# EasyEDA Pro project ProPrj_OHPP-001A-boltON.epro

# Schematic BoltON

## Sheets
1 BoltON: Board Name: Board1; Create Date: 2025-05-22; Page Name: BoltON; Project Name: OHPP-001A-boltON (radio board connector); Schematic Name: BoltON; Update Date: 2025-06-24; Company: Silicon Labs; Page Size: A3; Version: OHPP-001A
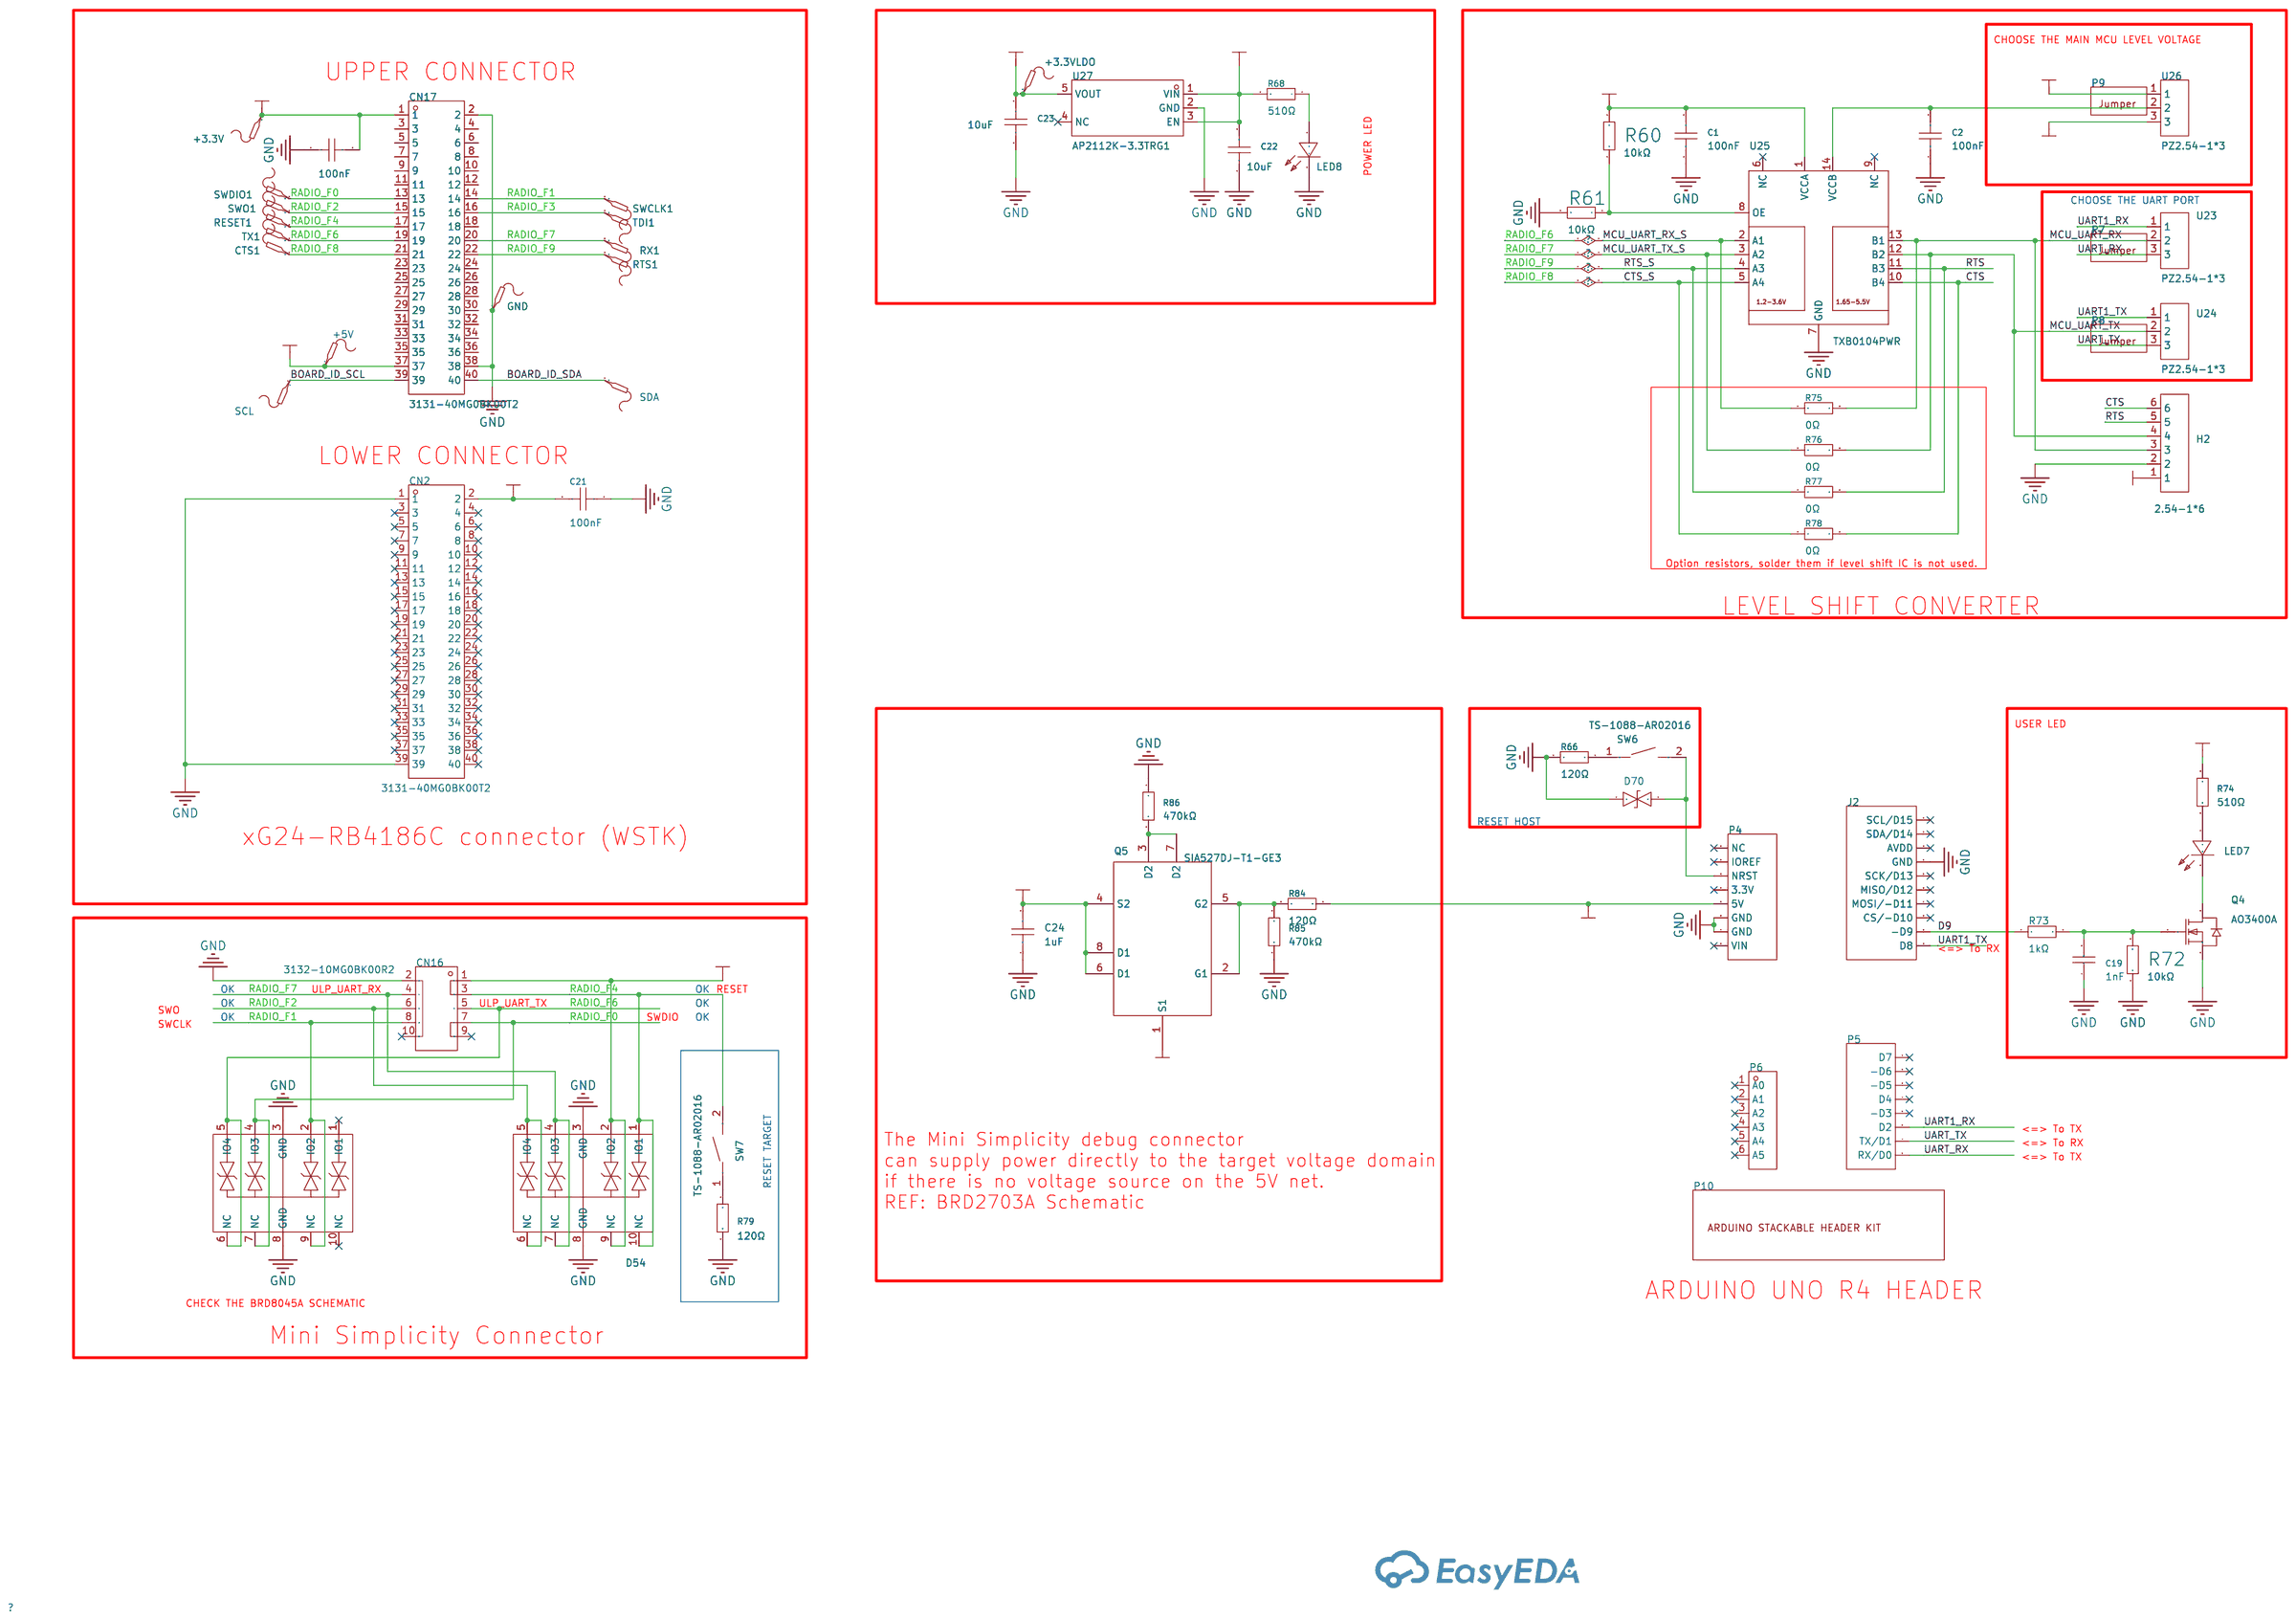
[diagram p0: BoltON]
2 Block Diagram: Page Name: Block Diagram; Project Name: boltON (radio board connector); Update Date: 2025-05-26
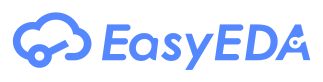
[diagram p1: Block Diagram]

## Parts
+3.3V  -  [Test-Point-0.5mm]  (no BOM)
+3.3VLDO  -  [Test-Point-0.5mm]  (no BOM)
+5V  -  [Test-Point-0.5mm]  (no BOM)
C1  100nF  [C0603]
C2  100nF  [C0603]
C19  1nF  [C0603]
C20  100nF  [C0603]
C21  100nF  [C0603]
C22  10uF  [C0603]
C23  10uF  [C0603]
C24  1uF  [C0603]
CN2  3131-40MG0BK00T2  [CONN-SMD_40P-P1.27_WCON_3131-40MG0BK00T2]
CN16  3132-10MG0BK00R2  [IDC-SMD_3132-10MG0BK00R2]
CN17  3131-40MG0BK00T2  [CONN-SMD_40P-P1.27_WCON_3131-40MG0BK00T2]
CTS1  -  [Test-Point-0.5mm]  (no BOM)
D54  TPD4E02B04DQAR  [USON-10_L2.5-W1.0-P0.50-BL]
D69  TPD4E02B04DQAR  [USON-10_L2.5-W1.0-P0.50-BL]
D70  TPD1E0B04DPLR  [TSSLP-2-3_L0.6-W0.3-P0.35-BI]  (no BOM)
GND  -  [Test-Point-0.5mm]  (no BOM)
H2  2.54-1*6  [HDR-TH_6P-P2.54-V-M]
J2  2.54-1*10P母  [HDR-TH_10P-P2.54-V-F]  (no BOM)
LED7  KT-0805G  [LED0805-R-RD]
LED8  NCD0805R1  [LED0805-R-RD]
P4  2.54-1*8P母环保  [HDR-TH_8P-P2.54-V-F-1]  (no BOM)
P5  2.54-1*8P母环保  [HDR-TH_8P-P2.54-V-F-1_1]  (no BOM)
P6  2.54-1*6P母  [HDR-TH_6P-P2.54-V-F]  (no BOM)
P7  -
P8  -
P9  -
P10  -
Q4  AO3400A  [SOT-23-3_L2.9-W1.3-P1.90-LS2.4-BR]
Q5  SIA527DJ-T1-GE3  [POWERPAK-SC-70-6_L2.0-W2.0-P0.65-BL]
R60  10kΩ  [R0603]
R61  10kΩ  [R0603]  (no BOM)
R66  120Ω  [R0603]
R68  510Ω  [R0603]
R72  10kΩ  [R0603]
R73  1kΩ  [R0603]
R74  510Ω  [R0603]
R75  0Ω  [R0402]  (no BOM)
R76  0Ω  [R0402]  (no BOM)
R77  0Ω  [R0402]  (no BOM)
R78  0Ω  [R0402]  (no BOM)
R79  120Ω  [R0603]
R84  120Ω  [R0603]
R85  470kΩ  [R0603]
R86  470kΩ  [R0603]  (no BOM)
RESET1  -  [Test-Point-0.5mm]  (no BOM)
RTS1  -  [Test-Point-0.5mm]  (no BOM)
RX1  -  [Test-Point-0.5mm]  (no BOM)
SCL  -  [Test-Point-0.5mm]  (no BOM)
SDA  -  [Test-Point-0.5mm]  (no BOM)
SW6  TS-1088-AR02016  [SW-SMD_L3.9-W3.0-P4.45]
SW7  TS-1088-AR02016  [SW-SMD_L3.9-W3.0-P4.45]
SWCLK1  -  [Test-Point-0.5mm]  (no BOM)
SWDIO1  -  [Test-Point-0.5mm]  (no BOM)
SWO1  -  [Test-Point-0.5mm]  (no BOM)
TDI1  -  [Test-Point-0.5mm]  (no BOM)
TX1  -  [Test-Point-0.5mm]  (no BOM)
U23  PZ2.54-1*3  [HDR-TH_3P-P2.54-V-M]
U24  PZ2.54-1*3  [HDR-TH_3P-P2.54-V-M]
U25  TXB0104PWR  [TSSOP-14_L5.0-W4.4-P0.65-LS6.4-BL]
U26  PZ2.54-1*3  [HDR-TH_3P-P2.54-V-M]
U27  AP2112K-3.3TRG1  [SOT-25-5_L2.9-W1.6-P0.95-LS2.8-BL]

## Library data of the parts
+3.3V +3.3VLDO +5V CTS1 GND RESET1 RTS1 RX1 SCL SDA SWCLK1 SWDIO1 SWO1 TDI1 TX1 = Test-Point: Test Point 测试点
C1 C2 C20 C21 = CC0603KRX7R9BB104: Capacitance: Tolerance:±10% Tolerance:±10% Voltage Rated: Temperature Coefficient:; LCSC Part Name: 100nF ±10% 50V; Supplier Part: C14663; Manufacturer: YAGEO(国巨); Supplier Footprint: 0603; JLCPCB Part Class: Basic Part; Datasheet: https://atta.szlcsc.com/upload/public/pdf/source/20180910/C282072_33301C7F631E79921B82A8DAC6BCC5B3.pdf; Supplier: LCSC; Tolerance: ±10%
C19 = CL10B102KB8NNNC: Capacitance: Tolerance:±10% Tolerance:±10% Voltage Rated: Temperature Coefficient:; LCSC Part Name: 1nF ±10% 50V; Supplier Part: C1588; Manufacturer: SAMSUNG(三星); Supplier Footprint: 0603; JLCPCB Part Class: Basic Part; Datasheet: https://atta.szlcsc.com/upload/public/pdf/source/20160218/1457707763339.pdf; Supplier: LCSC; Tolerance: ±10%
C22 C23 = CL10A106MA8NRNC: Capacitance: Tolerance:±20% Tolerance:±20% Voltage Rated: Temperature Coefficient:; LCSC Part Name: 10uF ±20% 25V; Supplier Part: C96446; Manufacturer: SAMSUNG(三星); Supplier Footprint: 0603; JLCPCB Part Class: Basic Part; Datasheet: https://atta.szlcsc.com/upload/public/pdf/source/20160218/1457707763339.pdf; Supplier: LCSC; Tolerance: ±20%
C24 = CL10A105KB8NNNC: Capacitance: Tolerance:±10% Tolerance:±10% Voltage Rated: Temperature Coefficient:; LCSC Part Name: 1uF ±10% 50V; Supplier Part: C15849; Manufacturer: SAMSUNG(三星); Supplier Footprint: 0603; JLCPCB Part Class: Basic Part; Datasheet: https://atta.szlcsc.com/upload/public/pdf/source/20160218/1457707763339.pdf; Supplier: LCSC; Tolerance: ±10%
CN2 = 3131-40MG0BK00T2: Connector Type:Simple cow constellation Pitch:1.27mm Number of Positions or Pins:2x20P Current Rating:1A Voltage Rating (Max):- Holder Type:Standing paste Row Spacing:1.27mm Number of Rows:2 Number of PINs Per Row:20 Operating Temperature:-40℃~+105℃ Opera; LCSC Part Name: 1.27mm 2x20P 排数:2 每排P数:20; Supplier Part: C976753; Manufacturer: Wcon(维峰电子); Supplier Footprint: SMD,P=1.27mm; JLCPCB Part Class: Extended Part; Datasheet: https://atta.szlcsc.com/upload/public/pdf/source/20211202/B702BBAB0AED51B28E1877A6EDDD5ECD.pdf; Supplier: LCSC; Connector Type: Simple cow constellation; Pitch: 1.27mm; Number of Positions or Pins: 2x20P; Current Rating: 1A; Holder Type: Standing paste; Row Spacing: 1.27mm; Number of Rows: 2; Number of PINs Per Row: 20; Operating Temperature: -40℃~+105℃
CN16 = 3132-10MG0BK00R2: Connector Type:简牛座 Pitch:1.27mm Structure:2x5P Holder Type:Brick nogging Row Spacing:1.27mm Number of Rows:2 Pin Number in each Row:5 Contact Material:Brass Contact Plating:Gold; Supplier: LCSC; Supplier Part: C783843; Manufacturer: Wcon(维峰电子); LCSC Part Name: 1.27mm 2x5P 排数:2 每排P数:5; Supplier Footprint: SMD,P=1.27mm; Datasheet: https://atta.szlcsc.com/upload/public/pdf/source/20200914/C783843_74B4F3B0F5055CA38342214C72674E3E.pdf; Connector Type: 简牛座; Pitch: 1.27mm; Structure: 2x5P; Holder Type: Brick nogging; Row Spacing: 1.27mm; Number of Rows: 2; Pin Number in each Row: 5; Contact Material: Brass; Contact Plating: Gold
CN17 = 3131-40MG0BK00T2-UP-CP-V1.0.0: Connector Type:Simple cow constellation Pitch:1.27mm Number of Positions or Pins:2x20P Current Rating:1A Voltage Rating (Max):- Holder Type:Standing paste Row Spacing:1.27mm Number of Rows:2 Number of PINs Per Row:20 Operating Temperature:-40℃~+105℃ Opera; LCSC Part Name: 1.27mm 2x20P 排数:2 每排P数:20; Supplier Part: C976753; Manufacturer: Wcon(维峰电子); Supplier Footprint: SMD,P=1.27mm; Datasheet: https://atta.szlcsc.com/upload/public/pdf/source/20211202/B702BBAB0AED51B28E1877A6EDDD5ECD.pdf; Supplier: LCSC; Connector Type: Simple cow constellation; Pitch: 1.27mm; Number of Positions or Pins: 2x20P; Current Rating: 1A; Holder Type: Standing paste; Row Spacing: 1.27mm; Number of Rows: 2; Number of PINs Per Row: 20; Operating Temperature: -40℃~+105℃
D54 D69 = TPD4E02B04DQAR: polarity:Bi-Directional Reverse Stand-Off Voltage (Vrwm):3.6V Maximum Clamping Voltage:8.8V Peak Pulse Current (Ipp)@10/1000us:5A Peak Pulse Power Dissipation (Ppp)@10/1000us:17W Breakdown Voltage:5.5V Operating Temperature:-40℃~+125℃@(Ta) Operating Tempe; LCSC Part Name: 双向ESD; Supplier Part: C106794; Manufacturer: TI(德州仪器); Supplier Footprint: USON-10(1x2.5); JLCPCB Part Class: Extended Part; Datasheet: https://www.ti.com/cn/lit/gpn/tpd4e02b04; Supplier: LCSC; polarity: Bi-Directional; Reverse Stand-Off Voltage (Vrwm): 3.6V; Maximum Clamping Voltage: 8.8V; Peak Pulse Current (Ipp)@10/1000us: 5A; Peak Pulse Power Dissipation (Ppp)@10/1000us: 17W; Breakdown Voltage: 5.5V; Operating Temperature: -40℃~+125℃@(Ta); Type: ESD
D70 = TPD1E0B04DPLR: polarity:- Reverse Stand-Off Voltage (Vrwm):3.6V Maximum Clamping Voltage:10.1V Peak Pulse Current (Ipp):1.7A@8/20us Peak Pulse Power Dissipation (Ppp):15W Breakdown Voltage:6.7V Reverse Leakage Current (Ir):- Number of Lines:- Operating Temperature:- Ope; Supplier Part: C913830; Manufacturer: TI(德州仪器); Supplier Footprint: X2-SON-2(0.3x0.6); JLCPCB Part Class: Extended Part; Datasheet: https://www.ti.com/cn/lit/gpn/tpd1e0b04; Supplier: LCSC; Reverse Stand-Off Voltage (Vrwm): 3.6V; Maximum Clamping Voltage: 10.1V; Peak Pulse Current (Ipp): 1.7A@8/20us; Peak Pulse Power Dissipation (Ppp): 15W; Breakdown Voltage: 6.7V; Type: TVS
H2 = 2.54-1*6: Pin Structure:1x6P Pitch:2.54mm Number of Rows:Single Row Number of Pins:6P; Supplier Part: C5156615; Manufacturer: ZHOURI(洲日); Supplier Footprint: 插件,P=2.54mm; JLCPCB Part Class: Extended Part; Datasheet: https://atta.szlcsc.com/upload/public/pdf/source/20250227/F941FC765EF241ABFB2D5D72948A31A5.pdf; Supplier: LCSC; Pin Structure: 1x6P; Pitch: 2.54mm; Number of Rows: Single Row; Number of Pins: 6P
J2 = Arduino_2.54-1*10P: Holes Structure:1x10P Pitch:2.54mm Row Spacing:- Mounting Type:Straight Number of Rows:Plugin Number of Holes:10P Insulation Height:- Contact Material:- Contact Plating:-; Supplier: LCSC; Manufacturer: BOOMELE(博穆精密); Supplier Part: C35445; LCSC Part Name: 间距:2.54mm 1x10P 直插; Supplier Footprint: 插件,P=2.54mm; Datasheet: https://atta.szlcsc.com/upload/public/pdf/source/20200813/C35445_A4147CED0A1C9075722E373C7771E928.pdf; Holes Structure: 1x10P; Pitch: 2.54mm; Mounting Type: Straight; Number of Rows: Plugin; Number of Holes: 10P
LED7 = KT-0805G: Lamp Holder Type:- Emitted Color:Emerald Forward Voltage (VF):- Forward Voltage (VF):- Power Dissipation:- Forward Current:- Dominant Wavelength:- Dominant Wavelength:- Peak Wavelength:- Diode Configuration:- Lens Color:- Color Temperature:- Color Tempera; LCSC Part Name: 0805 翠绿 高亮; Supplier Part: C2297; Manufacturer: KENTO; Supplier Footprint: 0805; JLCPCB Part Class: Basic Part; Datasheet: https://atta.szlcsc.com/upload/public/pdf/source/20170209/1486607340485.pdf; Supplier: LCSC; Emitted Color: Emerald
LED8 = NCD0805R1_C84256: Lamp Holder Type:- Emitted Color:Red Forward Voltage (VF):1.6V~2.6V Forward Voltage (VF):1.6V~2.6V Power Dissipation:65mW Forward Current:20mA Dominant Wavelength:615nm~630nm Dominant Wavelength:615nm~630nm Peak Wavelength:- Diode Configuration:独立二极管 Lens; Supplier Part: C84256; Manufacturer: 国星光电; Supplier Footprint: 0805; JLCPCB Part Class: Basic Part; Datasheet: https://atta.szlcsc.com/upload/public/pdf/source/20200820/C84256_F0A75A43B3EAD75808600A0514C76B99.pdf; Supplier: LCSC; Emitted Color: Red; Forward Voltage (VF): 1.6V~2.6V; Power Dissipation: 65mW; Forward Current: 20mA; Dominant Wavelength: 615nm~630nm; Diode Configuration: 独立二极管; Lens Color: 无色透明透镜; Luminous Intensity: 67mcd~195mcd; Viewing Angle: 130°; Operating Temperature: -30℃~+85℃
P4 = Arduino_2.54-1*8P: Holes Structure:1x8P Pitch:2.54mm Row Spacing:- Mounting Type:Straight Number of Rows:Plugin Number of Holes:8P Insulation Height:- Contact Material:- Contact Plating:-; Supplier: LCSC; Manufacturer: BOOMELE(博穆精密); Supplier Part: C27438; LCSC Part Name: 间距:2.54mm 1x8P 直插; Supplier Footprint: 插件,P=2.54mm; Datasheet: https://atta.szlcsc.com/upload/public/pdf/source/20231221/1CA800C6799ED97958773716FAA1BFFE.pdf; Holes Structure: 1x8P; Pitch: 2.54mm; Mounting Type: Straight; Number of Rows: Plugin; Number of Holes: 8P
P5 = Arduino_2.54-1*8P_1: Holes Structure:1x8P Pitch:2.54mm Row Spacing:- Mounting Type:Straight Number of Rows:Plugin Number of Holes:8P Insulation Height:- Contact Material:- Contact Plating:-; Supplier: LCSC; Manufacturer: BOOMELE(博穆精密); Supplier Part: C27438; LCSC Part Name: 间距:2.54mm 1x8P 直插; Supplier Footprint: 插件,P=2.54mm; Datasheet: https://atta.szlcsc.com/upload/public/pdf/source/20231221/1CA800C6799ED97958773716FAA1BFFE.pdf; Holes Structure: 1x8P; Pitch: 2.54mm; Mounting Type: Straight; Number of Rows: Plugin; Number of Holes: 8P
P6 = Arduino_2.54-1*6P: Holes Structure:1x6P Pitch:2.54mm Row Spacing:- Mounting Type:Straight Number of Rows:Plugin Number of Holes:6P Insulation Height:- Contact Material:- Contact Plating:-; Supplier: LCSC; Manufacturer: BOOMELE(博穆精密); Supplier Part: C40877; LCSC Part Name: 间距:2.54mm 1x6P 直插; Supplier Footprint: 插件,P=2.54mm; Datasheet: https://atta.szlcsc.com/upload/public/pdf/source/20210301/C2718488_F4427B881E42CAA8DDB0B1C12B3A522C.pdf; Holes Structure: 1x6P; Pitch: 2.54mm; Mounting Type: Straight; Number of Rows: Plugin; Number of Holes: 6P
P7-P9 = Jumpers: Open top 3A 2.54mm P=2.54mm Shunts, Jumpers ROHS; Part Number: 2.54短路帽开口; LCSC Part Name: C5305
P10 = 11417: ARDUINO STACKABLE HEADER KIT - R
Q4 = AO3400A_C20917: Type:1 N-Channel Drain Source Voltage (Vdss): Continuous Drain Current (Id): Drain Source On Resistance (RDS(on)@Vgs,Id):26.5mΩ@10V,5.7A Power Dissipation (Pd): Gate Threshold Voltage (Vgs(th)@Id):1.5V@250uA Total Gate Charge (Qg@Vgs):7nC@4.5V Input Capac; LCSC Part Name: 1个N沟道 耐压:30V 电流:5.7A; Supplier Part: C20917; Manufacturer: AOS; Supplier Footprint: SOT-23-3L; JLCPCB Part Class: Basic Part; Datasheet: https://atta.szlcsc.com/upload/public/pdf/source/20140107/1457706668533.pdf; Supplier: LCSC; Type: 1 N-Channel; Drain Source On Resistance (RDS(on)@Vgs,Id): 26.5mΩ@10V,5.7A; Gate Threshold Voltage (Vgs(th)@Id): 1.5V@250uA; Total Gate Charge (Qg@Vgs): 7nC@4.5V; Input Capacitance (Ciss@Vds): 630pF@15V; Operating Temperature: -55℃~+150℃@(Tj)
Q5 = SIA527DJ-T1-GE3-CP-V1.0.0: Type:1 N-Channel + 1 P-Channel Drain Source Voltage (Vdss): Continuous Drain Current (Id): Drain Source On Resistance (RDS(on)@Vgs,Id):0.041Ω@4.5V,4.5A Power Dissipation (Pd): Gate Threshold Voltage (Vgs(th)@Id):400mV@250uA Total Gate Charge (Qg@Vgs):10.5; LCSC Part Name: 1个N沟道+1个P沟道 耐压:12V 电流:4.5A; Supplier Part: C222486; Manufacturer: VISHAY(威世); Supplier Footprint: PowerPAK-SC-70-6; Datasheet: https://atta.szlcsc.com/upload/public/pdf/source/20180518/C222486_7B4636894C9CF71AB66FFADFF3F49BDD.pdf; Supplier: LCSC; Type: 1 N-Channel + 1 P-Channel; Drain Source On Resistance (RDS(on)@Vgs,Id): 0.041Ω@4.5V,4.5A; Gate Threshold Voltage (Vgs(th)@Id): 400mV@250uA; Total Gate Charge (Qg@Vgs): 10.5nC@4.5V; Input Capacitance (Ciss@Vds): 1500pF@6V; Reverse Transfer Capacitance (Crss@Vds): 250pF@6V; Operating Temperature: -55℃~+150℃
R60 R61 R72 = 0603WAF1002T5E: Type:Thick Film Resistors Resistance:10kΩ Tolerance:±1% Tolerance:±1% Power(Watts): Overload Voltage (Max): Temperature Coefficient:±100ppm/℃ Temperature Coefficient:±100ppm/℃ Operating Temperature Range:-55℃~+155℃ Operating Temperature Range:-55℃~+155℃; LCSC Part Name: 厚膜电阻 10kΩ ±1% 100mW; Supplier Part: C25804; Manufacturer: UNI-ROYAL(厚声); Supplier Footprint: 0603; JLCPCB Part Class: Basic Part; Datasheet: https://atta.szlcsc.com/upload/public/pdf/source/20200306/C422600_1E6D84923E4A46A82E41ADD87F860B5C.pdf; Supplier: LCSC; Type: Thick Film Resistors; Tolerance: ±1%; Temperature Coefficient: ±100ppm/℃; Operating Temperature Range: -55℃~+155℃
R66 R79 R84 = 0603WAF1200T5E: Type:Thick Film Resistors Resistance: Tolerance:±1% Tolerance:±1% Power(Watts): Overload Voltage (Max): Temperature Coefficient:±100ppm/℃ Temperature Coefficient:±100ppm/℃ Operating Temperature Range:-55℃~+155℃ Operating Temperature Range:-55℃~+155℃; LCSC Part Name: 120Ω ±1% 100mW 厚膜电阻; Supplier Part: C22787; Manufacturer: UNI-ROYAL(厚声); Supplier Footprint: 0603; JLCPCB Part Class: Basic Part; Datasheet: https://atta.szlcsc.com/upload/public/pdf/source/20200306/C422600_1E6D84923E4A46A82E41ADD87F860B5C.pdf; Supplier: LCSC; Type: Thick Film Resistors; Tolerance: ±1%; Temperature Coefficient: ±100ppm/℃; Operating Temperature Range: -55℃~+155℃
R68 R74 = 0603WAF5100T5E: Type:Thick Film Resistors Resistance: Tolerance:±1% Tolerance:±1% Power(Watts): Overload Voltage (Max): Temperature Coefficient:±100ppm/℃ Temperature Coefficient:±100ppm/℃ Operating Temperature Range:-55℃~+155℃ Operating Temperature Range:-55℃~+155℃; LCSC Part Name: 510Ω ±1% 100mW 厚膜电阻; Supplier Part: C23193; Manufacturer: UNI-ROYAL(厚声); Supplier Footprint: 0603; JLCPCB Part Class: Basic Part; Datasheet: https://atta.szlcsc.com/upload/public/pdf/source/20200306/C422600_1E6D84923E4A46A82E41ADD87F860B5C.pdf; Supplier: LCSC; Type: Thick Film Resistors; Tolerance: ±1%; Temperature Coefficient: ±100ppm/℃; Operating Temperature Range: -55℃~+155℃
R73 = 0603WAF1001T5E: Type:Thick Film Resistors Resistance:1kΩ Tolerance:±1% Tolerance:±1% Power(Watts): Overload Voltage (Max): Temperature Coefficient:±100ppm/℃ Temperature Coefficient:±100ppm/℃ Operating Temperature Range:-55℃~+155℃ Operating Temperature Range:-55℃~+155℃; LCSC Part Name: 1kΩ ±1% 100mW 厚膜电阻; Supplier Part: C21190; Manufacturer: UNI-ROYAL(厚声); Supplier Footprint: 0603; JLCPCB Part Class: Basic Part; Datasheet: https://atta.szlcsc.com/upload/public/pdf/source/20200306/C422600_1E6D84923E4A46A82E41ADD87F860B5C.pdf; Supplier: LCSC; Type: Thick Film Resistors; Tolerance: ±1%; Temperature Coefficient: ±100ppm/℃; Operating Temperature Range: -55℃~+155℃
R75-R78 = 0402WGF0000TCE: Type:Thick Film Resistors Resistance: Tolerance:±1% Tolerance:±1% Power(Watts): Overload Voltage (Max): Temperature Coefficient:±800ppm/℃ Temperature Coefficient:±800ppm/℃ Operating Temperature Range:-55℃~+155℃ Operating Temperature Range:-55℃~+155℃; LCSC Part Name: 0Ω ±1% 62.5mW 厚膜电阻; Supplier Part: C17168; Manufacturer: UNI-ROYAL(厚声); Supplier Footprint: 0402; JLCPCB Part Class: Basic Part; Datasheet: https://atta.szlcsc.com/upload/public/pdf/source/20200306/C422600_1E6D84923E4A46A82E41ADD87F860B5C.pdf; Supplier: LCSC; Type: Thick Film Resistors; Tolerance: ±1%; Temperature Coefficient: ±800ppm/℃; Operating Temperature Range: -55℃~+155℃
R85 R86 = 0603WAF4703T5E: Type:Thick Film Resistors Resistance:470kΩ Tolerance:±1% Tolerance:±1% Power(Watts): Overload Voltage (Max): Temperature Coefficient:±100ppm/℃ Temperature Coefficient:±100ppm/℃ Operating Temperature Range:-55℃~+155℃ Operating Temperature Range:-55℃~+155℃; LCSC Part Name: 470kΩ ±1% 100mW 厚膜电阻; Supplier Part: C23178; Manufacturer: UNI-ROYAL(厚声); Supplier Footprint: 0603; JLCPCB Part Class: Basic Part; Datasheet: https://atta.szlcsc.com/upload/public/pdf/source/20200306/C422600_1E6D84923E4A46A82E41ADD87F860B5C.pdf; Supplier: LCSC; Type: Thick Film Resistors; Tolerance: ±1%; Temperature Coefficient: ±100ppm/℃; Operating Temperature Range: -55℃~+155℃
SW6 SW7 = TS-1088-AR02016: Circuit:SPST Actuator Style:Round Button Operating Force:160gf Mounting Style:Brick nogging Switch Length:4mm Switch Width:3mm Switch Height:2mm Strike Gundam:不带 Contact Current:50mA Voltage Rating (DC):12V Insulation Resistance:100MΩ Actuator/Cap Color:B; LCSC Part Name: 4*3*2mm 立贴 轻触开关; Supplier Part: C720477; Manufacturer: XUNPU(讯普); Supplier Footprint: SMD; JLCPCB Part Class: Basic Part; Datasheet: https://atta.szlcsc.com/upload/public/pdf/source/20200810/C720475_60D09DD6C54279ADDB2DC25100F1CC11.pdf; Supplier: LCSC; Circuit: SPST; Actuator Style: Round Button; Operating Force: 160gf; Mounting Style: Brick nogging; Switch Length: 4mm; Switch Width: 3mm; Switch Height: 2mm; Strike Gundam: 不带; Contact Current: 50mA; Voltage Rating (DC): 12V; Insulation Resistance: 100MΩ; Actuator/Cap Color: Black; Pin Style: SMDSplicing; Mechanical Life: 10万次; Operating Temperature: -30℃~+80℃
U23 U24 U26 = PZ2.54-1*3: Supplier Part: C5360899; Manufacturer: ZHOURI(洲日); Supplier Footprint: 插件,P=2.54mm; JLCPCB Part Class: Extended Part; Datasheet: https://atta.szlcsc.com/upload/public/pdf/source/20250227/F941FC765EF241ABFB2D5D72948A31A5.pdf; Supplier: LCSC
U25 = TXB0104PWR: Channel Type:Bidirectional Input Signal:- Output Signal:- Data Rate:100Mbps Voltage - Supply(VCCA):1.2V~3.6V Voltage - Supply(VCCA):1.2V~3.6V Voltage - Supply(VCCB):1.65V~5.5V Voltage - Supply(VCCB):1.65V~5.5V Number of Circuits:1 Number of Circuits:4 Out; LCSC Part Name: 100Mbps 4位双向电平转换器; Supplier Part: C60708; Manufacturer: TI(德州仪器); Supplier Footprint: TSSOP-14; JLCPCB Part Class: Extended Part; Datasheet: http://www.ti.com/cn/lit/gpn/txb0104; Supplier: LCSC; Channel Type: Bidirectional; Data Rate: 100Mbps; Voltage - Supply(VCCA): 1.2V~3.6V; Voltage - Supply(VCCB): 1.65V~5.5V; Number of Circuits: 4; Output Type: Tri-State; Operating Temperature: -40℃~+85℃; Features: Automatic Direction Detection
U27 = AP2112K-3.3TRG1: Output Type:Fixed Maximum Input Voltage:6V Output Voltage:3.3V Output Voltage:3.3V Output Current:600mA Power Supply Rejection Ratio (PSRR):65dB@(1kHz) Dropout Voltage:400mV@(600mA) standby current:80uA Feature:ESD Protection；Automatic Discharge Function；; LCSC Part Name: 输入6V 输出3.3V 600mA; Supplier Part: C51118; Manufacturer: DIODES(美台); Supplier Footprint: SOT-25-5; JLCPCB Part Class: Extended Part; Datasheet: https://atta.szlcsc.com/upload/public/pdf/source/20171221/C51118_15138312998391195590.pdf; Supplier: LCSC; Output Type: Fixed; Maximum Input Voltage: 6V; Output Voltage: 3.3V; Output Current: 600mA; Power Supply Rejection Ratio (PSRR): 65dB@(1kHz); Dropout Voltage: 400mV@(600mA); standby current: 80uA; Feature: ESD Protection；Automatic Discharge Function；Low ESR；Thermal Protection(TSD)；Overcurrent Protection(OCP)；With ability; Operating Temperature: -40℃~+85℃; Output Polarity: Positive electrode; Number of Outputs: 1

## Nets
+3.3V_EFR: +3.3V.1 C1.2 C20.2 C21.2 C24.2 CN2.2 CN16.1 CN17.1 D54.2(IO2) D54.9(NC) Q5.4(S2) Q5.6(D1) Q5.8(D1) R60.2 U25.1(VCCA)
+3V3_LDO: +3.3VLDO.1 C23.2 H2.1 Q5.1(S1) U26.1 U27.5(VOUT)
+5V_HOST: +5V.1 C22.2 CN17.37 P4.5(5V) R68.2 R74.1 R84.1 U26.3 U27.1(VIN) U27.3(EN)
GND: C1.1 C2.1 C19.1 C20.1 C21.1 C22.1 C23.1 C24.1 CN2.1 CN2.39 CN16.2 CN17.2 CN17.38 D54.3(GND) D54.8(GND) D69.3(GND) D69.8(GND) D70.1(IO) GND.1 H2.2 J2.4(GND) LED8.2(-) P4.6(GND) P4.7(GND) Q4.2(S) R61.2 R66.2 R72.1 R79.2 R85.1 R86.1 U25.7(GND) U27.2(GND)
BOARD_ID_SCL: CN17.39 SCL.1
BOARD_ID_SDA: CN17.40 SDA.1
CTS: H2.6 R78.2 U25.10(B4)
CTS_S: CN17.21 CTS1.1 R78.1 U25.5(A4)
D9: J2.9(-D9) R73.1
MCU_UART_RX: H2.3 R75.2 U23.2 U25.13(B1)
MCU_UART_RX_S: CN16.5 CN17.19 D69.5(IO4) D69.6(NC) R75.1 TX1.1 U25.2(A1)
MCU_UART_TX: H2.4 R76.2 U24.2 U25.12(B2)
MCU_UART_TX_S: CN16.4 CN17.20 D54.4(IO3) D54.7(NC) R76.1 RX1.1 U25.3(A2)
RADIO_F0: CN16.7 CN17.13 D69.4(IO3) D69.7(NC) SWDIO1.1
RADIO_F1: CN16.8 CN17.14 D69.2(IO2) D69.9(NC) SWCLK1.1
RADIO_F2: CN16.6 CN17.15 D54.5(IO4) D54.6(NC) SWO1.1
RADIO_F3: CN17.16 TDI1.1
RADIO_F4: CN16.3 CN17.17 D54.1(IO1) D54.10(NC) RESET1.1 SW7.2
RADIO_F9: CN17.22 R77.1 RTS1.1 U25.4(A3)
RTS: H2.5 R77.2 U25.11(B3)
UART1_RX: P5.6(D2) U23.1
UART1_TX: J2.10(D8) U24.1
UART_RX: P5.8(RX/D0) U23.3
UART_TX: P5.7(TX/D1) U24.3
$1N4928: C2.2 U25.14(VCCB) U26.2
$1N5104: R60.1 R61.1 U25.8(OE)
$1N5772: D70.2(IO) P4.3(NRST) SW6.2
$1N7727: C19.2 Q4.1(G) R72.2 R73.2
$1N7731: LED7.2(K) Q4.3(D)
$1N7734: LED7.1(A) R74.2
$1N14282: R66.1 SW6.1
$1N15613: R79.1 SW7.1
$1N21196: Q5.3(D2) Q5.7(D2) R86.2
$1N21478: LED8.1(+) R68.1
$1N22098: Q5.2(G1) Q5.5(G2) R84.2 R85.2

Not connected (* = marked no-connect by the designer): CN2 3* 4* 5* 6* 7* 8* 9* 10* 11* 12* 13* 14* 15* 16* 17* 18* 19* 20* 21* 22* 23* 24* 25* 26* 27* 28* 29* 30* 31* 32* 33* 34* 35* 36* 37* 38* 40*; CN16 9* 10*; CN17 3 4 5 6 7 8 9 10 11 12 18 23 24 25 26 27 28 29 30 31 32 33 34 35 36; D69 1(IO1)* 10(NC)*; J2 1(SCL/D15)* 2(SDA/D14)* 3(AVDD)* 5(SCK/D13)* 6(MISO/D12)* 7(MOSI/-D11)* 8(CS/-D10)*; P4 1(NC)* 2(IOREF)* 4(3.3V)* 8(VIN)*; P5 1(D7)* 2(-D6)* 3(-D5)* 4(D4)* 5(-D3)*; P6 1(A0)* 2(A1)* 3(A2)* 4(A3)* 5(A4)* 6(A5)*; U25 6(NC)* 9(NC)*; U27 4(NC)*

## Notes on the sheets
sheet 1
- CHOOSE THE MAIN MCU LEVEL VOLTAGE
- UPPER CONNECTOR
- POWER LED
- CHOOSE THE UART PORT
- LOWER CONNECTOR
- Option resistors, solder them if level shift IC is not used.
- LEVEL SHIFT CONVERTER
- USER LED
- RESET HOST
- xG24-RB4186C connector (WSTK)
- <=> To RX
- OK
- ULP_UART_RX
- OK
- RESET
- SWO
- OK
- OK
- ULP_UART_TX
- SWDIO
- OK
- OK
- SWCLK
- <=> To TX
- <=> To RX
- <=> To TX
- RESET TARGET
- The Mini Simplicity debug connector
  can supply power directly to the target voltage domain
  if there is no voltage source on the 5V net.
  REF: BRD2703A Schematic
- ARDUINO UNO R4 HEADER
- CHECK THE BRD8045A SCHEMATIC
- Mini Simplicity Connector

# Board BoltON
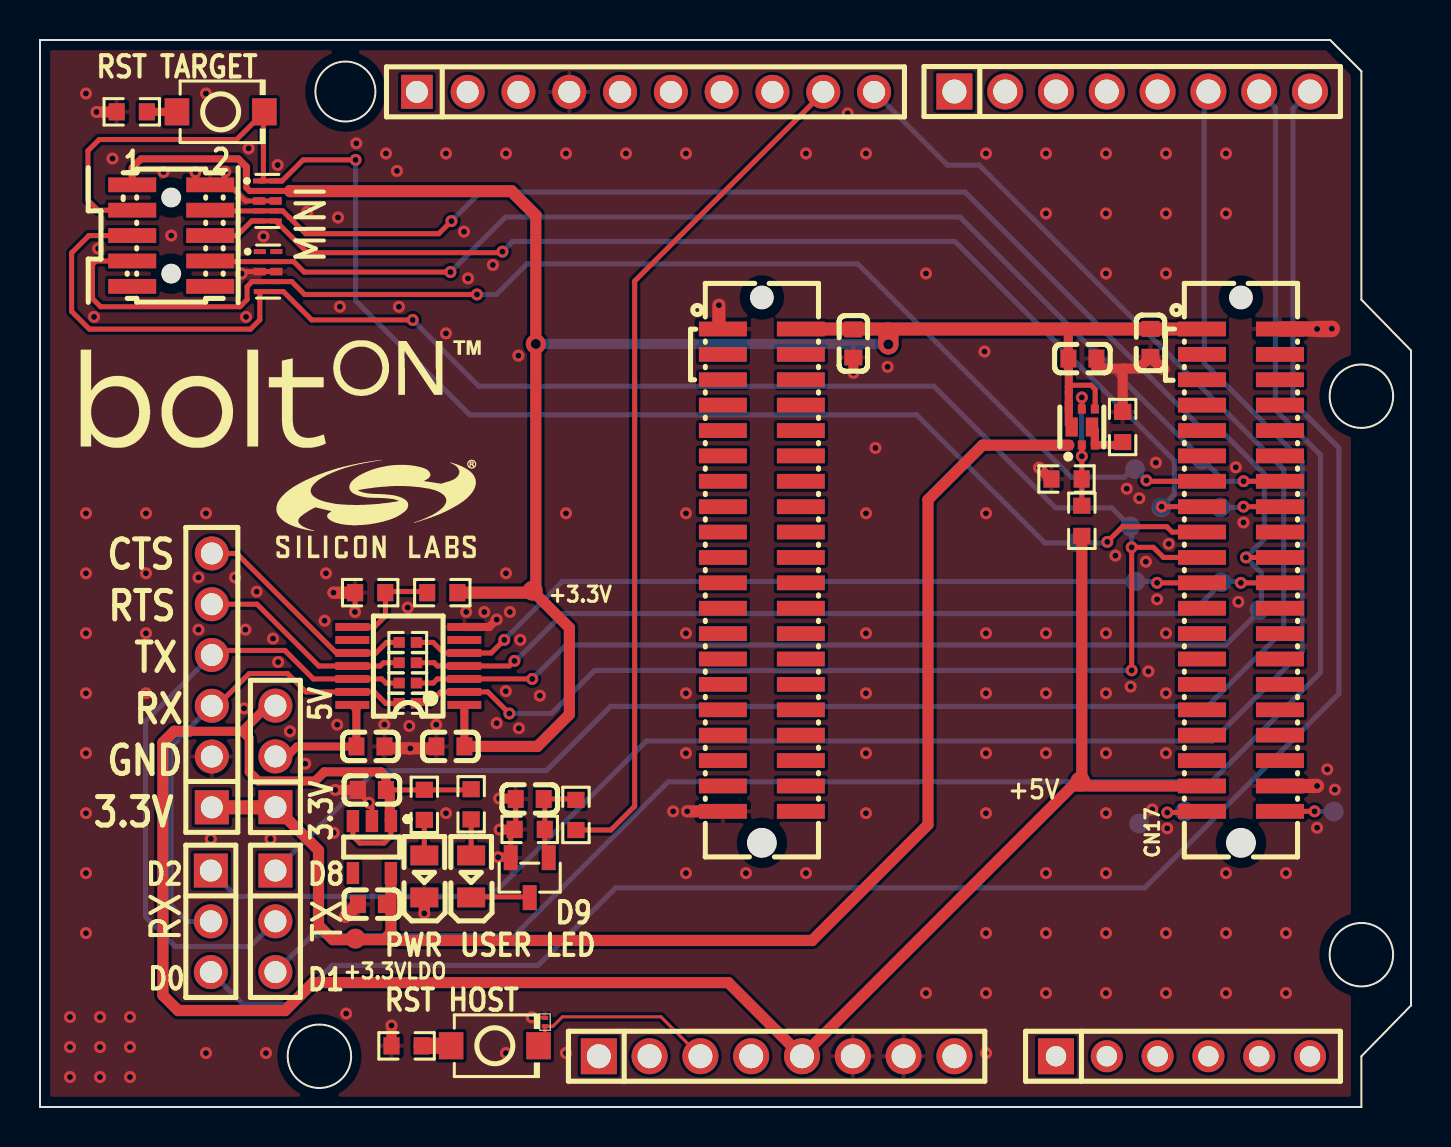
[diagram p2: board, top side]
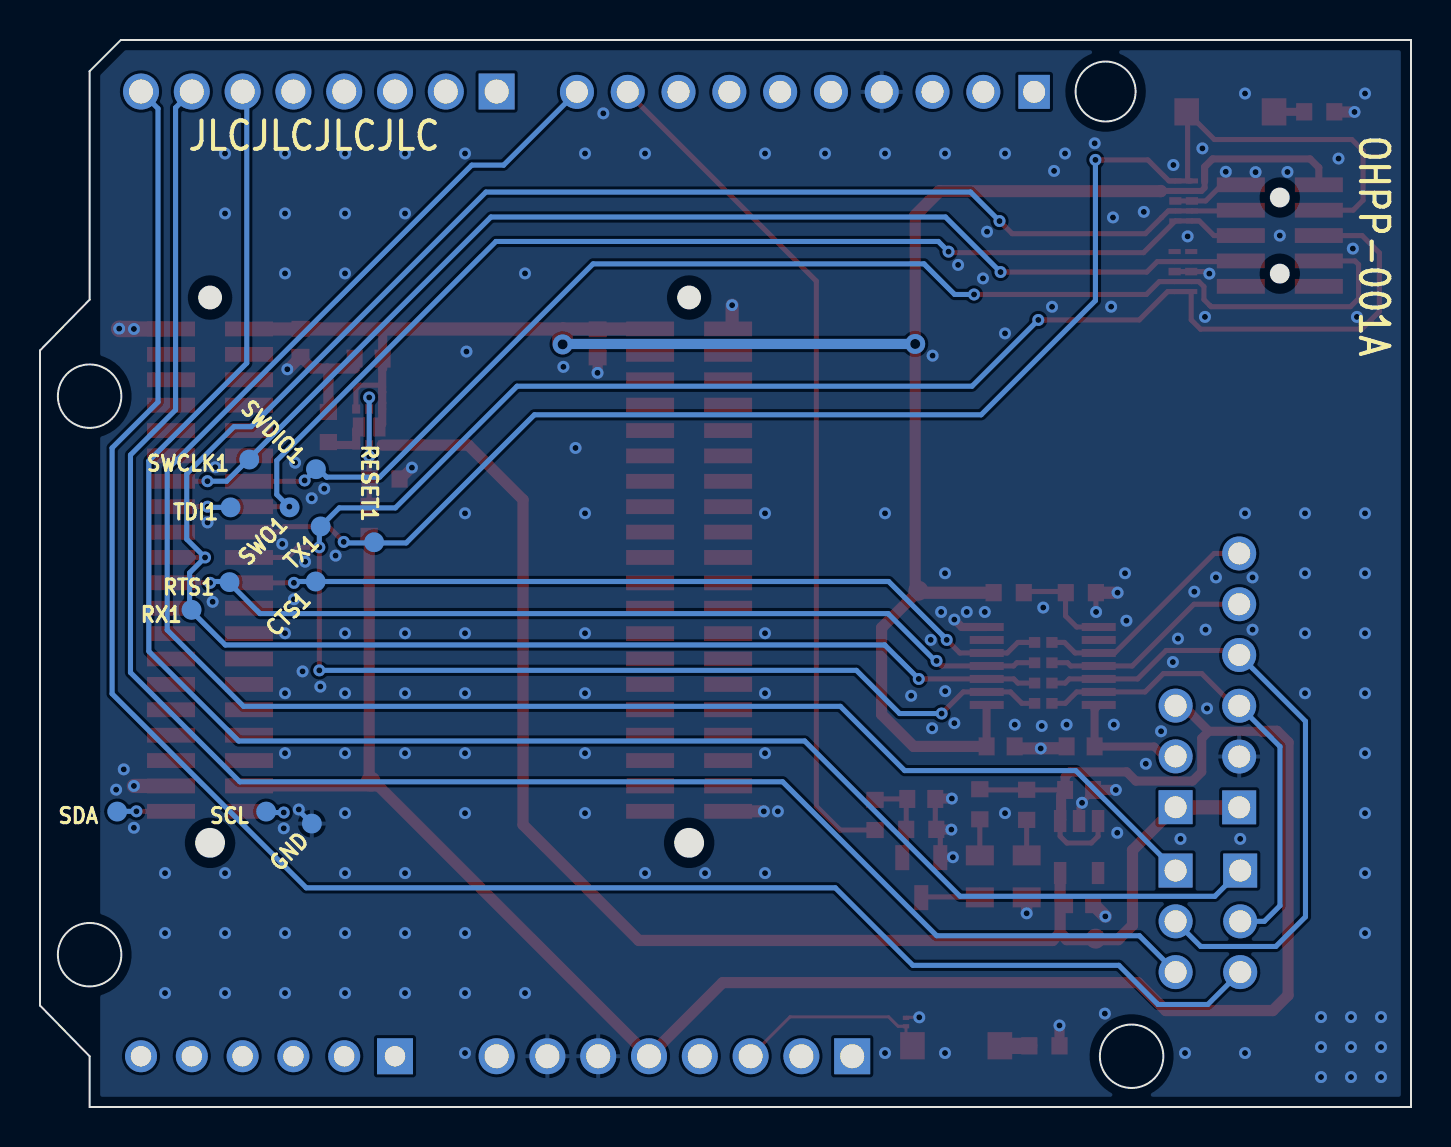
[diagram p3: board, bottom side, seen from below]

Outline 68.55 x 53.38 mm; copper layers: Top Layer, Inner1, Inner2, Bottom Layer. Coordinates in mm from the lower left corner of the outline.
Outline path: circle c13.97,2.54 r1.59 ; circle c15.27,50.8 r1.5 ; circle c66.07,35.56 r1.59 ; circle c66.07,7.62 r1.59 ; 0,0 0,53.38 64.5,53.38 66.07,51.81 66.07,40.39 68.55,37.85 68.55,5.08 66.07,2.54 66.07,0 0,0
Stack: Top Layer 0.035mm Outer layer thickness 1oz / Dielectric1 0.2104mm 7628 RC49% 8.6mil / Inner1 0.0152mm Inner layer thickness / Dielectric2 1.065mm 1.1mm H/HOZ Copper / Inner2 0.0152mm Inner layer thickness / Dielectric3 0.2104mm 7628 RC49% 8.6mil / Bottom Layer 0.035mm Outer layer thickness 1oz

## Design rules (mm)
template: Custom Config
spacing copperThickness1oz (default): track to track 0.203, other pairs 0.152 to 0.508
spacing copperThickness2oz: track to track 0.203, other pairs 0.152 to 0.3
spacing copperThicknessInner0.5oz: track to track 0.152, other pairs 0.152 to 0.3
spacing Power: track to track 0.152, other pairs 0.102 to 0.3
track width copperThickness1oz (default): min 0.127, default 0.254, max 2.54
track width copperThickness2oz: min 0.203, default 0.254, max 2.54
track width AUTO: min 0.203, default 0.203, max 1.016
track width ForGND: min 0.203, default 0.381, max 1.27
track width power: min 0.203, default 0.508, max 1.016
track width SC50: min 0.203, default 0.203, max 0.203
track width Single50: min 0.356, default 0.356, max 0.356
differential pair differentialPair (default): width min 0.127, default 0.254, max 2.54; gap min 0.152, default 0.152
differential pair differentialPair90: width min 0.208, default 0.208, max 0.208; gap min 0.127, default 0.274
via viaSize (default): diameter min 0.6, default 0.6, max 1; hole min 0.3, default 0.3, max 0.5

## Placement (name value [footprint] x y rotation side)
+3.3V  -  [Test-Point-0.5mm]  24.63 25.83 0 top
+3.3VLDO  -  [Test-Point-0.5mm]  15.77 8.42 0 top
+5V  -  [Test-Point-0.5mm]  52.01 16.28 0 top
C1  100nF  [C0603]  20.52 18.04 0 top
C2  100nF  [C0603]  16.52 18.04 180 top
C19  1nF  [C0603]  24.49 15.41 0 top
C20  100nF  [C0603]  55.52 38.23 90 top
C21  100nF  [C0603]  40.67 38.2 90 top
C22  10uF  [C0603]  16.59 15.86 0 top
C23  10uF  [C0603]  16.59 10.15 0 top
C24  1uF  [C0603]  52.12 37.44 180 top
CN2  3131-40MG0BK00T2  [CONN-SMD_40P-P1.27_WCON_3131-40MG0BK00T2]  36.09 26.86 90 top
CN16  3132-10MG0BK00R2  [IDC-SMD_3132-10MG0BK00R2]  6.56 43.59 270 top
CN17  3131-40MG0BK00T2  [CONN-SMD_40P-P1.27_WCON_3131-40MG0BK00T2]  60.05 26.86 90 top
CTS1  -  [Test-Point-0.5mm]  54.77 26.29 180 bottom
D54  TPD4E02B04DQAR  [USON-10_L2.5-W1.0-P0.50-BL]  11.37 45.33 270 top
D69  TPD4E02B04DQAR  [USON-10_L2.5-W1.0-P0.50-BL]  11.41 41.79 270 top
D70  TPD1E0B04DPLR  [TSSLP-2-3_L0.6-W0.3-P0.35-BI]  25.25 4.25 270 top
GND  -  [Test-Point-0.5mm]  54.96 14.18 180 bottom
H2  2.54-1*6  [HDR-TH_6P-P2.54-V-M]  8.59 21.34 90 top
J2  2.54-1*10P母  [HDR-TH_10P-P2.54-V-F]  30.27 50.78 0 top
LED7  KT-0805G  [LED0805-R-RD]  21.56 11.54 90 top
LED8  NCD0805R1  [LED0805-R-RD]  19.22 11.54 90 top
P4  2.54-1*8P母环保  [HDR-TH_8P-P2.54-V-F-1]  36.83 2.54 0 top
P5  2.54-1*8P母环保  [HDR-TH_8P-P2.54-V-F-1_1]  54.61 50.8 0 top
P6  2.54-1*6P母  [HDR-TH_6P-P2.54-V-F]  57.15 2.54 0 top
Q4  AO3400A  [SOT-23-3_L2.9-W1.3-P1.90-LS2.4-BR]  24.49 11.47 90 top
Q5  SIA527DJ-T1-GE3  [POWERPAK-SC-70-6_L2.0-W2.0-P0.65-BL]  52.09 34.02 0 top
R60  10kΩ  [R0603]  20.12 25.73 0 top
R61  10kΩ  [R0603]  16.51 25.73 180 top
R66  120Ω  [R0603]  18.33 3.06 180 top
R68  510Ω  [R0603]  19.22 15.12 90 top
R72  10kΩ  [R0603]  24.49 13.89 0 top
R73  1kΩ  [R0603]  26.8 14.61 90 top
R74  510Ω  [R0603]  21.56 15.14 270 top
R75  0Ω  [R0402]  18.39 20.19 180 top
R76  0Ω  [R0402]  18.39 21.21 180 top
R77  0Ω  [R0402]  18.39 22.22 180 top
R78  0Ω  [R0402]  18.39 23.24 180 top
R79  120Ω  [R0603]  4.59 49.78 180 top
R84  120Ω  [R0603]  52.09 29.33 90 top
R85  470kΩ  [R0603]  51.33 31.42 0 top
R86  470kΩ  [R0603]  54.13 34.02 270 top
RESET1  -  [Test-Point-0.5mm]  51.84 28.25 180 bottom
RTS1  -  [Test-Point-0.5mm]  59.07 26.26 180 bottom
RX1  -  [Test-Point-0.5mm]  60.97 24.87 180 bottom
SCL  -  [Test-Point-0.5mm]  57.24 14.78 180 bottom
SDA  -  [Test-Point-0.5mm]  64.69 14.78 180 bottom
SW6  TS-1088-AR02016  [SW-SMD_L3.9-W3.0-P4.45]  22.74 3.07 0 top
SW7  TS-1088-AR02016  [SW-SMD_L3.9-W3.0-P4.45]  9.03 49.78 0 top
SWCLK1  -  [Test-Point-0.5mm]  58.09 32.39 180 bottom
SWDIO1  -  [Test-Point-0.5mm]  54.75 31.91 180 bottom
SWO1  -  [Test-Point-0.5mm]  56.07 30 180 bottom
TDI1  -  [Test-Point-0.5mm]  59.02 30 180 bottom
TX1  -  [Test-Point-0.5mm]  54.52 29.04 180 bottom
U23  PZ2.54-1*3  [HDR-TH_3P-P2.54-V-M]  8.54 9.29 270 top
U24  PZ2.54-1*3  [HDR-TH_3P-P2.54-V-M]  11.77 9.29 270 top
U25  TXB0104PWR  [TSSOP-14_L5.0-W4.4-P0.65-LS6.4-BL]  18.41 22.06 90 top
U26  PZ2.54-1*3  [HDR-TH_3P-P2.54-V-M]  11.77 17.54 90 top
U27  AP2112K-3.3TRG1  [SOT-25-5_L2.9-W1.6-P0.95-LS2.8-BL]  16.59 13 180 top

## Footprints (pads in the part's own frame, mm; a bottom-side part is the same pattern mirrored in y, then rotated)
C0603
  rect 0.8x0.9 smd: 1(-0.7,0) 2(0.7,0)
CONN-SMD_40P-P1.27_WCON_3131-40MG0BK00T2
  rect 0.74x2.4 smd: 1(12.065,1.95) 2(12.065,-1.95) 3(10.795,1.95) 4(10.795,-1.95) 5(9.525,1.95) 6(9.525,-1.95) 7(8.255,1.95) 8(8.255,-1.95) 9(6.985,1.95) 10(6.985,-1.95) 11(5.715,1.95) 12(5.715,-1.95) 13(4.445,1.95) 14(4.445,-1.95) 15(3.175,1.95) 16(3.175,-1.95) 17(1.905,1.95) 18(1.905,-1.95) 19(0.635,1.95) 20(0.635,-1.95) 21(-0.635,1.95) 22(-0.635,-1.95) 23(-1.905,1.95) 24(-1.905,-1.95) 25(-3.175,1.95) 26(-3.175,-1.95) 27(-4.445,1.95) 28(-4.445,-1.95) 29(-5.715,1.95) 30(-5.715,-1.95) 31(-6.985,1.95) 32(-6.985,-1.95) 33(-8.255,1.95) 34(-8.255,-1.95) 35(-9.525,1.95) 36(-9.525,-1.95) 37(-10.795,1.95) 38(-10.795,-1.95) 39(-12.065,1.95) 40(-12.065,-1.95)
HDR-TH_3P-P2.54-V-M
  rect 1.7x1.7 hole 1.1: 1(-2.54,0)
  round 1.7 hole 1.1: 2(0,0) 3(2.54,0)
HDR-TH_6P-P2.54-V-F
  rect 1.8x1.8 hole 1.02: 1(-6.35,0)
  round 1.6 hole 1.02: 2(-3.81,0) 3(-1.27,0) 4(1.27,0) 5(3.81,0) 6(6.35,0)
HDR-TH_6P-P2.54-V-M
  rect 1.7x1.7 hole 1.1: 1(-6.35,0)
  round 1.7 hole 1.1: 2(-3.81,0) 3(-1.27,0) 4(1.27,0) 5(3.81,0) 6(6.35,0)
HDR-TH_8P-P2.54-V-F-1
  rect 1.8x1.8 hole 1.2: 1(-8.89,0)
  round 1.8 hole 1.2: 2(-6.35,0) 3(-3.81,0) 4(-1.27,0) 5(1.27,0) 6(3.81,0) 7(6.35,0) 8(8.89,0)
HDR-TH_8P-P2.54-V-F-1_1
  rect 1.8x1.8 hole 1.2: 1(-8.89,0)
  round 1.8 hole 1.2: 2(-6.35,0) 3(-3.81,0) 4(-1.27,0) 5(1.27,0) 6(3.81,0) 7(6.35,0) 8(8.89,0)
HDR-TH_10P-P2.54-V-F
  rect 1.575x1.7 hole 1.1: 1(-11.43,0)
  round 1.7 hole 1.1: 2(-8.89,0) 3(-6.35,0) 4(-3.81,0) 5(-1.27,0) 6(1.27,0) 7(3.81,0) 8(6.35,0) 9(8.89,0) 10(11.43,0)
IDC-SMD_3132-10MG0BK00R2
  rect 0.74x2.4 smd: 1(-2.54,-1.95) 2(-2.54,1.95) 3(-1.27,-1.95) 4(-1.27,1.95) 5(0,-1.95) 6(0,1.95) 7(1.27,-1.95) 8(1.27,1.95) 9(2.54,-1.95) 10(2.54,1.95)
LED0805-R-RD
  rect 1x1.399 smd: 1(1.05,0) 2(-1.05,0)
POWERPAK-SC-70-6_L2.0-W2.0-P0.65-BL
  rect 0.4x0.46 smd: 1(-0.65,-0.9) 2(0,-0.9) 3(0.65,-0.9) 4(0.65,0.9) 5(0,0.9) 6(-0.65,0.9)
  rect 0.62x0.95 smd: 7(0.508,0) 8(-0.508,0)
R0402
  rect 0.566x0.54 smd: 1(-0.433,0) 2(0.433,0)
R0603
  rect 0.806x0.864 smd: 1(-0.753,0) 2(0.753,0)
SOT-23-3_L2.9-W1.3-P1.90-LS2.4-BR
  rect 1.25x0.7 smd: 1(1,-0.95) 2(1,0.95) 3(-1,0)
SOT-25-5_L2.9-W1.6-P0.95-LS2.8-BL
  rect 0.623x1.105 smd: 1(-0.95,-1.3) 2(-0.001,-1.3) 3(0.95,-1.3) 4(0.95,1.3) 5(-0.95,1.3)
SW-SMD_L3.9-W3.0-P4.45
  rect 1.23x1.36 smd: 1(-2.185,0) 2(2.185,0)
Test-Point-0.5mm
  round 1 smd: 1(0,0)
TSSLP-2-3_L0.6-W0.3-P0.35-BI
  rect 0.21x0.32 smd: 1(-0.21,0) 2(0.21,0)
TSSOP-14_L5.0-W4.4-P0.65-LS6.4-BL
  rect 0.4x1.7 smd: 1(-1.95,-2.8) 2(-1.3,-2.8) 3(-0.65,-2.8) 4(0,-2.8) 5(0.65,-2.8) 6(1.3,-2.8) 7(1.95,-2.8) 8(1.95,2.8) 9(1.3,2.8) 10(0.65,2.8) 11(0,2.8) 12(-0.65,2.8) 13(-1.3,2.8) 14(-1.95,2.8)
USON-10_L2.5-W1.0-P0.50-BL
  rect 0.25x0.609 smd: 1(-1,-0.414) 2(-0.5,-0.414) 4(0.5,-0.414) 5(1,-0.414) 6(1,0.414) 7(0.5,0.414) 9(-0.5,0.414) 10(-1,0.414)
  rect 0.38x0.609 smd: 3(0,-0.414) 8(0,0.414)

## Nets
As in the schematic.

Pads without a net: CN2 3 4 5 6 7 8 9 10 11 12 13 14 15 16 17 18 19 20 21 22 23 24 25 26 27 28 29 30 31 32 33 34 35 36 37 38 40; CN16 9 10; CN17 3 4 5 6 7 8 9 10 11 12 18 23 24 25 26 27 28 29 30 31 32 33 34 35 36; D69 1 10; J2 1 2 3 5 6 7 8; P4 1 2 4 8; P5 1 2 3 4 5; P6 1 2 3 4 5 6; U25 6 9; U27 4

## Via types
v1: diameter 0.599, hole 0.3, Top Layer to Bottom Layer, 186 vias
v2: diameter 0.6, hole 0.3, Top Layer to Bottom Layer, 30 vias
v3: diameter 1, hole 0.5, Top Layer to Bottom Layer, 2 vias

## Routing (per net, layer and track width the routed paths; a pad name or vN(x,y) marks a point on that pad's centre or on a via; arc(x,y) is an arc through that point)
+3.3V_EFR: length 106.4
  Top Layer w0.254: 52.74,34.92 52.75,34.93 52.75,35.9 52.55,36.11 51.53,36.11 51.44,36.02
  Top Layer w0.3: 12.5,45.83 D54.9 D54.2 10.47,45.83 10.32,45.98 10.32,46.28
  Top Layer w0.355: CN16.1 4.61,46.99 5.05,47.43 9.92,47.43 10.32,47.03 10.32,46.28
  Top Layer w0.406: Q5.8 51.44,34.16 Q5.6 51.44,35.22 51.44,35.23 51.44,35.77 51.44,35.77 51.44,36.91 ; U25.1 21.22,20.11 C1.2
  Top Layer w0.457: 51.41,36.94 51.41,38.92
  Top Layer w0.559: 24.79,44.6 v3(24.79,38.17) 24.79,25.81 24.71,25.73 26.47,23.97 26.47,19.64 24.87,18.04 C1.2
  Top Layer w0.605: 24.79,44.6 23.58,45.81 12.51,45.81 12.5,45.83
  Top Layer w0.61: R60.2 24.71,25.73
  Top Layer w0.66: 42.39,38.92 CN17.1 ; 42.39,38.92 42.42,38.9 42.42,38.69 ; 42.39,38.92 CN2.2
  Top Layer w1.016: v3(42.42,38.15) 42.42,38.69
  Bottom Layer w0.508: v3(24.79,38.17) 42.4,38.17 v3(42.42,38.15)
+3V3_LDO: length 70.9
  Top Layer w0.559: 51.44,33.11 47.13,33.11 44.4,30.38 44.4,14.12 38.61,8.33 17.92,8.33 17.54,8.71 ; 17.54,8.71 17.21,8.37 14.64,8.37 13.93,9.09 13.93,12.84 U26.1 ; 17.54,8.71 U27.5
  Top Layer w0.711: U26.1 11.76,14.99 H2.1
+5V_HOST: length 111.4
  Top Layer w0.254: 17.49,15.61 17.29,15.81 ; 15.65,14.3 15.65,13.55 15.98,13.21 17.21,13.21 17.54,13.55 17.54,14.3 ; R74.1 21.52,15.86 C22.2
  Top Layer w0.457: 10.11,18.8 10.47,18.44 10.47,16.76 10.92,16.31 13.76,16.31 14.22,16.77 17.05,16.77 17.29,16.52 C22.2 ; 10.11,18.8 11.39,20.08 U26.3 ; 10.11,18.8 7.47,18.8
  Top Layer w0.508: 17.49,15.61 17.49,14.36 17.54,14.3
  Top Layer w0.559: 51.62,16.06 38.1,2.54 34.42,6.22 13.66,6.22 12.26,4.83 6.91,4.83 6.15,5.59 6.15,18.24 6.71,18.8 7.47,18.8 ; 51.62,16.06 52.09,16.53 R84.1 ; 51.62,16.06 CN17.37
GND: length 42.5
  Top Layer w0.152: v1(24.59,4.49) 25.22,4.49 D70.1
  Top Layer w0.254: v1(15.75,24.76) 15.76,24.77 R61.2 ; 9.45,46.13 CN16.2 7.85,46.13 7.77,46.21 v1(7.77,46.77) ; 9.45,46.13 9.46,46.13 10.26,45.33 D54.3 D54.8 ; 9.45,46.13 9.21,46.37 9.21,46.74 v1(9.26,46.79) ; C22.1 15.9,15.77 v2(16.45,15.22) 16.45,15.12 16.6,14.97 16.6,14.3 ; 23.72,13.88 23.54,13.69 Q4.2 ; v1(10.08,41.69) 10.19,41.79 D69.3 D69.8 ; C19.1 23.79,13.94
  Top Layer w0.406: U25.7 22.46,24.01 v1(22.83,24.38)
  Top Layer w0.457: v1(22.91,12.5) 23.51,12.5 Q4.2
  Top Layer w0.508: R66.2 v1(17.58,4.08) ; v1(22.96,15.43) 23.77,15.43 C19.1 ; C21.1 40.67,36.73 v1(40.67,36.73) ; 23.79,13.94 R72.1 23.72,13.88 v1(22.98,13.88) ; C22.1 v1(14.76,15.86) ; 52.81,36.94 54.18,36.94 ; 54.18,36.94 54.13,36.89 R86.1 ; 54.18,36.94 54.94,36.94 C20.1 ; v1(49.95,31.98) 50.52,31.42 R85.1
  Top Layer w0.559: v1(56.18,36.91) 56.14,36.91 C20.1 ; LED8.2 v1(19.22,9.69) ; v1(2.83,49.78) 3.83,49.78 R79.2
  Top Layer w0.61: 33.94,14.79 v1(32.36,14.79) ; C1.1 19.72,17.94 v1(18.51,17.94) 18.51,17.94 17.31,17.94 C2.1 ; R61.2 v1(14.67,25.73)
  Top Layer w0.66: 33.94,38.92 v1(33.94,40.11) ; C23.1 v1(15.28,9.54)
  Top Layer w0.711: CN17.38 v1(63.85,16.06)
  Top Layer w0.762: CN17.2 v1(63.85,38.92)
  Top Layer w0.813: v1(64.59,38.94) 64.57,38.92 v1(63.85,38.92)
  Bottom Layer w0.254: v1(55.61,14.88) 55.61,14.83 GND.1
  vias: v1(2.3,50.7) v1(2.3,29.7) v1(2.3,26.7) v1(2.3,23.7) v1(2.3,20.7) v1(2.3,17.7) v1(2.3,14.7) v1(2.3,11.7) v1(2.3,8.7) v1(3,3) v1(3.62,47.45) v1(5.3,29.7) v1(5.3,26.7) v1(5.3,23.7) v1(5.3,20.7) v1(7.92,26.49) v1(7.92,23.88) v1(8.3,50.7) v1(8.3,29.7) v1(8.3,2.7) v1(9.75,26.49) v1(10.27,23.88) v1(10.43,47.95) v1(10.83,25.78) v1(11.3,2.7) v1(11.65,23.43) v1(11.91,22.26) v1(14.3,26.7) v1(14.9,44.5) v1(14.86,19.13) v1(15.31,4.67) v1(15.81,48.21) v1(17.22,19.13) v1(17.3,47.7) v1(17.85,46.83) v1(17.95,40.03) v1(18.39,24.99) v1(18.46,19.06) v1(19.81,19.13) v1(20.3,47.7) v1(20.3,38.7) v1(20.3,14.7) v1(21.2,43.79) v1(21.31,24.76) v1(21.4,41.45) v1(22.21,24.76) v1(22.83,19.2) v1(23.3,47.7) v1(23.3,26.7) v1(23.29,20.8) v1(23.3,2.7) v1(23.49,24.76) v1(24.01,23.37) v1(23.94,18.95) v1(24.99,20.57) v1(26.3,47.7) v1(26.3,29.7) v1(26.3,2.7) v1(29.3,47.7) v1(31.66,14.79) v1(32.3,47.7) v1(32.3,29.7) v1(32.3,23.7) v1(32.3,20.7) v1(32.3,17.7) v1(32.3,11.7) v1(35.3,11.7) v1(38.3,47.7) v1(38.3,11.7) v1(40.38,49.71) v1(41.3,47.7) v1(41.3,29.7) v1(41.3,23.7) v1(41.3,20.7) v1(41.3,17.7) v1(41.3,14.7) v1(41.77,32.97) v1(44.3,41.7) v1(44.3,5.7) v1(47.3,47.7) v1(47.3,29.7) v1(47.3,23.7) v1(47.3,20.7) v1(47.3,17.7) v1(47.3,14.7) v1(47.3,8.7) v1(47.3,5.7) v1(47.3,2.7) v1(50.3,47.7) v1(50.3,44.7) v1(50.3,23.7) v1(50.3,20.7) v1(50.3,17.7) v1(50.3,11.7) v1(50.3,8.7) v1(50.3,5.7) v1(53.3,47.7) v1(53.3,44.7) v1(53.3,41.7) v1(53.3,23.7) v1(53.3,20.7) v1(53.3,17.7) v1(53.3,14.7) v1(53.3,11.7) v1(53.3,8.7) v1(53.3,5.7) v1(53.77,27.58) v1(54.34,30.93) v1(54.53,21.03) v1(54.96,30.45) v1(55.29,27.28) v1(55.42,21.79) v1(55.85,25.4) v1(56.3,47.7) v1(56.3,44.7) v1(56.3,41.7) v1(56.3,23.7) v1(56.3,20.7) v1(56.3,17.7) v1(56.3,8.7) v1(56.3,5.7) v1(56.36,13.94) v1(56.44,28.17) v1(59.3,47.7) v1(59.3,44.7) v1(59.3,11.7) v1(59.3,8.7) v1(59.3,5.7) v1(59.79,32) v1(59.92,25.27) v1(60.17,29.24) v1(62.3,11.7) v1(62.3,8.7) v1(62.3,5.7) v1(63.85,13.97) v1(64.36,16.89) v1(64.74,15.87) v2(1.5,4.5) v2(1.5,3) v2(1.5,1.5) v2(2.7,39.53) v2(2.91,42.94) v2(3,4.5) v2(3,1.5) v2(4.5,4.5) v2(4.5,3) v2(4.5,1.5) v2(6.18,46.77) v2(6.56,43.59) v2(8.54,13.41) v2(10.2,19.94) v2(10.3,39.53) v2(11.17,43.55) v2(11.53,13.41) v2(11.88,47.12) v2(12.5,18.8) v2(13.26,17.17) v2(13.36,44.78) v2(14.23,24.33) v2(14.69,13.72) v2(14.99,40.04) v2(22.64,42.13) v2(23.92,37.59) v2(42.38,37.03) v2(47.23,37.79) v2(55.79,32.23)
BOARD_ID_SCL: length 2.7
  Top Layer w0.254: CN17.39 58.04,14.73 v1(56.36,14.73)
  Bottom Layer w0.254: SCL.1 57.19,14.73 v1(56.36,14.73)
BOARD_ID_SDA: length 2.7
  Top Layer w0.254: CN17.40 v1(63.73,14.79)
  Bottom Layer w0.254: v1(63.73,14.79) 64.68,14.79 SDA.1
CTS: length 11.6
  Top Layer w0.254: R78.2 17.32,23.24 16.8,22.71 14.82,22.71 9.84,27.69 H2.6
CTS_S: length 41
  Top Layer w0.254: v1(23.21,23.37) 22.56,22.71 U25.5 20.19,22.71 19.66,23.24 R78.1 ; CN17.21 v1(55.85,26.22)
  Bottom Layer w0.254: v1(55.85,26.22) 55.79,26.29 CTS1.1 26.12,26.29 23.44,23.61 23.44,23.59 v1(23.21,23.37)
D9: length 43.1
  Top Layer w0.254: R73.1 28.54,13.86 29.73,15.04 29.73,41.32 39.16,50.75 J2.9
MCU_UART_RX: length 23.8
  Top Layer w0.254: H2.3 8.85,20.07 10.46,21.68 12.38,21.68 13.3,20.76 16.72,20.76 17.29,20.19 R75.2
  Bottom Layer w0.254: H2.3 6.55,18.03 6.55,10.07 7.33,9.29 U23.2
MCU_UART_RX_S: length 114.4
  Top Layer w0.254: v1(18.63,39.37) 13.59,39.37 12.17,40.79 D69.6 D69.5 10.99,39.38 10.53,38.91 2.47,38.91 1.58,39.8 1.58,42.73 2.45,43.59 CN16.5 ; CN17.19 56.18,27.49 55.67,28 v1(54.58,28) v1(54.58,21.84) ; R75.1 19.46,20.19 20.03,20.76 U25.2 22.39,20.76 v1(23.47,19.68)
  Bottom Layer w0.254: v1(23.47,19.68) 25.57,19.68 27.73,21.84 v1(54.58,21.84) ; 54.56,29.08 54.58,29.06 v1(54.58,28) ; v1(18.63,39.37) 21.95,36.06 44.7,36.06 50.78,29.97 53.59,29.97 TX1.1
MCU_UART_TX: length 32.2
  Top Layer w0.254: R76.2 17.29,21.21 17.09,21.41 13.67,21.41 12.25,22.84 8.82,22.84 H2.4
  Bottom Layer w0.254: U24.2 10.51,8.03 6.76,8.03 5.28,9.51 5.28,19.3 H2.4
MCU_UART_TX_S: length 112.8
  Top Layer w0.254: v1(24.61,21.41) U25.3 19.86,21.41 19.66,21.21 R76.1 ; CN16.4 8.55,44.83 D54.4 D54.7 12.14,44.83 12.46,44.51 12.46,44.51 13.28,43.69 19.94,43.69 v1(20.57,44.32) ; CN17.20 v1(60.3,27.49)
  Bottom Layer w0.254: v1(20.57,44.32) 22.02,45.77 46.25,45.77 57.99,34.04 58.85,34.04 61.21,31.67 61.21,28.41 v1(60.3,27.49) 61.07,26.72 61.07,24.9 59.28,23.11 26.31,23.11 v1(24.61,21.41)
RADIO_F0: length 66.1
  Top Layer w0.254: CN17.13 55.36,31.3 v1(55.32,31.34) ; CN16.7 2.8,42.32 2.62,42.15 2.62,40.44 3.03,40.04 9.99,40.04 10.06,40.1 10.06,40.1 10.35,40.39 10.35,41.04 10.61,41.29 12.58,41.29 13.23,40.65 v1(21.85,40.65)
  Bottom Layer w0.254: v1(21.85,40.65) 22.82,40.65 24.35,42.18 40.9,42.18 51.56,31.51 54.22,31.51 54.43,31.71 54.44,31.7 54.54,31.7 SWDIO1.1 ; 54.75,31.91 v1(55.32,31.34)
RADIO_F1: length 60.3
  Top Layer w0.254: v1(20.52,41.77) 13.21,41.77 12.69,42.29 8.54,42.29 CN16.8 ; CN17.14 60.18,31.3 v1(60.18,31.31)
  Bottom Layer w0.254: v1(60.18,31.31) 59.22,31.31 46,44.52 23.28,44.52 v1(20.52,41.77)
RADIO_F2: length 58.6
  Top Layer w0.254: CN16.6 9.85,43.59 10.58,44.33 D54.5 D54.6 13.37,42.74 23.07,42.74 v1(23.12,42.79) ; CN17.15 v1(56.08,30.03)
  Bottom Layer w0.254: v1(23.12,42.79) 23.63,43.3 45.75,43.3 56.71,32.34 56.71,30.64 SWO1.1
RADIO_F3: length 2.6
  Top Layer w0.254: CN17.16 v1(60.17,30.03)
  Bottom Layer w0.254: 59.4,30 60.14,30 v1(60.17,30.03)
RADIO_F4: length 77.9
  Top Layer w0.254: v1(15.78,47.38) 13.16,47.38 12.1,46.33 D54.10 11.09,46.33 ; CN16.3 2.89,44.86 2.4,45.36 2.4,47.84 2.96,48.4 9.83,48.4 10.95,49.52 ; 10.95,49.52 11.17,49.3 11.17,46.41 11.09,46.33 ; 10.95,49.52 SW7.2 ; v1(53.36,28.27) 54.13,29.03 56.34,29.03 56.61,28.76 CN17.17 ; 11.09,46.33 D54.1
  Bottom Layer w0.254: v1(15.78,47.38) 15.78,40.34 21.49,34.63 43.83,34.63 50.24,28.22 53.31,28.22 v1(53.36,28.27)
RADIO_F9: length 45
  Top Layer w0.254: R77.1 19.71,22.22 19.87,22.06 U25.4 23.47,22.06 v1(23.72,22.32) ; CN17.22 v1(60.04,26.22)
  Bottom Layer w0.254: 23.71,22.31 v1(23.72,22.32) 23.78,22.32 26.15,24.68 57.55,24.68 59.16,26.29 59.98,26.29 v1(60.04,26.22)
RTS: length 10.7
  Top Layer w0.254: H2.5 10.85,25.15 13.94,22.06 17.01,22.06 17.18,22.22 R77.2
UART1_RX: length 90.3
  Bottom Layer w0.254: 8.52,11.83 9.81,10.54 22.55,10.54 30.31,18.31 58.62,18.31 63.11,22.8 63.11,32.32 58.21,37.21 58.21,50.59 58.42,50.8
UART1_TX: length 91.9
  Bottom Layer w0.254: 11.69,11.76 16.76,16.83 25.32,16.83 28.53,20.04 58.37,20.04 62.19,23.86 62.19,31.89 46.96,47.12 45.37,47.12 J2.10
UART_RX: length 94.9
  Bottom Layer w0.254: U23.3 10.16,5.13 12.65,5.13 14.61,7.09 24.91,7.09 28.78,10.96 55.24,10.96 64.94,20.67 64.94,32.97 62.65,35.27 62.65,49.95 P5.8
UART_TX: length 88.9
  Bottom Layer w0.254: P5.7 61.77,49.99 61.77,34.87 64.03,32.62 64.03,21.74 58.56,16.27 31.42,16.27 23.72,8.57 13.58,8.57 11.69,6.68
$1N4928: length 6.4
  Top Layer w0.406: 15.61,20.11 15.82,19.91 C2.2 15.82,18.03 12.84,18.03 12.35,17.54 U26.2
$1N5104: length 5.4
  Top Layer w0.254: 19.52,25.79 17.27,25.79 17.27,24.57 16.72,24.01 15.61,24.01
$1N5772: length 9.9
  Top Layer w0.152: SW6.2 25.25,3.39 D70.2 25.65,4.04 26.12,4.51 31.05,4.51 P4.3
$1N7727: length 4.6
  Top Layer w0.254: 25.19,15.41 26.75,15.41 26.8,15.36 ; Q4.1 25.24,12.67 R72.2 25.24,15.36 25.25,15.37
$1N7731: length 3.1
  Top Layer w0.254: Q4.3 24.45,10.51 21.89,10.51 21.56,10.84
$1N7734: length 1.7
  Top Layer w0.254: R74.2 21.56,12.69
$1N14282: length 1.5
  Top Layer w0.813: SW6.1 20.55,3.06 R66.1
$1N15613: length 1.5
  Top Layer w0.406: R79.1 SW7.1
$1N21196: length 2.4
  Top Layer w0.406: Q5.7 52.74,33.88 52.74,33.12 53.99,33.12 R86.2
$1N21478: length 1.8
  Top Layer w0.254: R68.1 LED8.1
$1N22098: length 6.6
  Top Layer w0.254: R84.2 v1(52.09,32.56) Q5.2 ; Q5.5 v1(52.09,35.5)
  Bottom Layer w0.254: v1(52.09,35.5) v1(52.09,32.56)

## Copper pours and planes (outline as drawn; the poured copper is in the pictures)
GND on Top Layer: -1,54 65.54,54 65.54,-1 -1,-1
GND on Bottom Layer: -1,54 65.54,54 65.54,-1 -1,-1
GND on Inner1: -1,54 65.54,54 65.54,-1 -1,-1
GND on Inner2: -1,54 65.54,54 65.54,-1 -1,-1

## Text on the board
Bottom Silkscreen Layer: OHPP-001A | JLCJLCJLCJLC
Component Marking Layer: ANTENNA
Top Solder Mask Layer: GND | TEST
Top Silkscreen Layer: 1 | 2 | RST HOST | 5V | 3.3V | RST TARGET | D2 | D8 | D1 | USER LED | D9 | D0 | PWR | RX | TX | MINI | CTS | GND | RTS
